# EAGLE design ipod_connector (EAGLE 5.10)
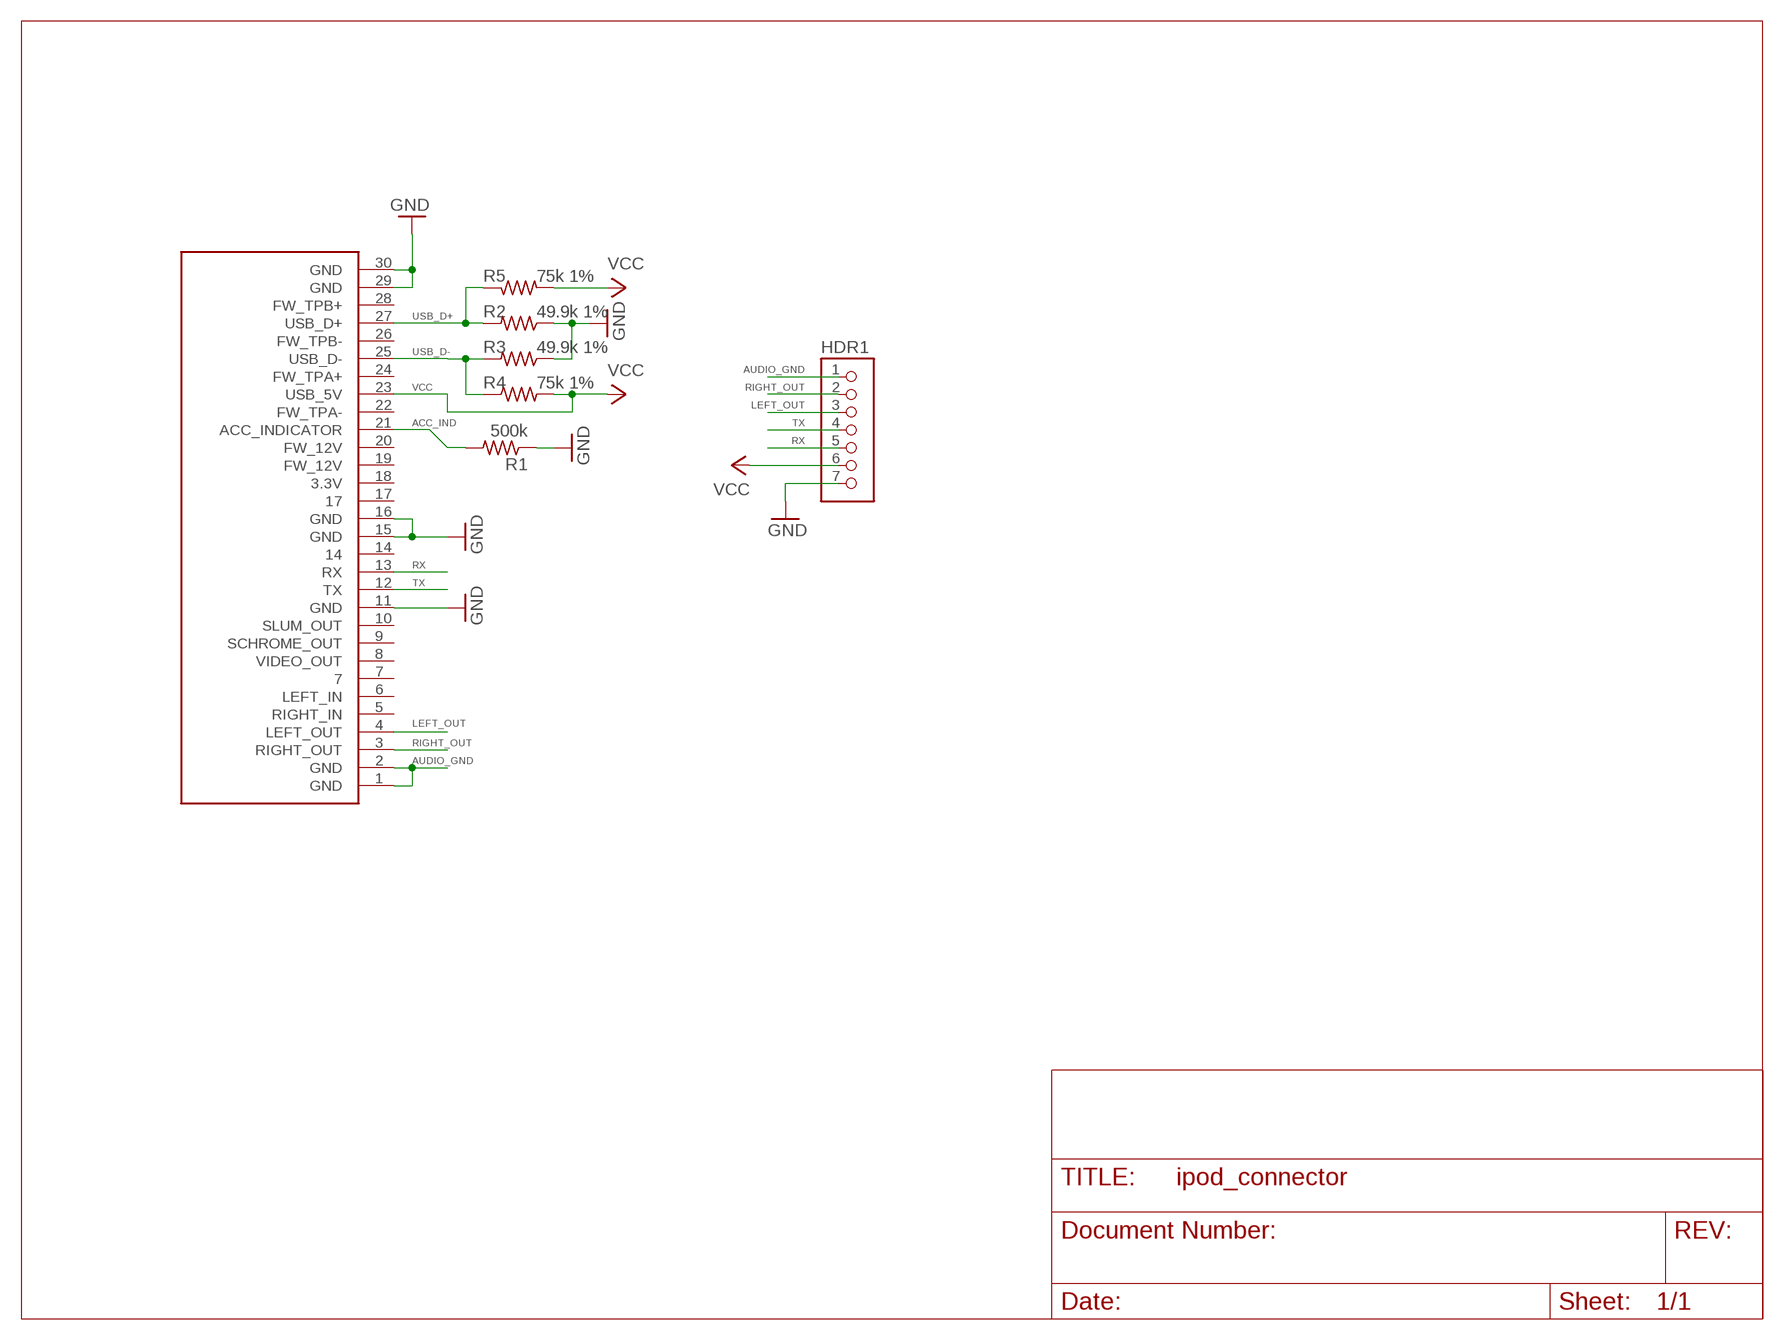
[diagram p0: schematic, sheet 1]

## Parts
HDR1  SMHDR-1X7  [SMHDR-1X7]
R1  500k  R-US_R0603  [R0603]
R2  49.9k 1%  R-US_R0603  [R0603]
R3  49.9k 1%  R-US_R0603  [R0603]
R4  75k 1%  R-US_R0603  [R0603]
R5  75k 1%  R-US_R0603  [R0603]
U$1  IPOD_CONNECTOR_MALE  [IPOD_MALE_CONNECTOR]

## Nets
ACC_IND: R1.2 U$1.21(ACC_INDICATOR)
AUDIO_GND: HDR1.1 U$1.1(GND) U$1.2(GND)
GND: HDR1.7 R1.1 R2.1 R3.1 U$1.11(GND) U$1.15(GND) U$1.16(GND) U$1.29(GND) U$1.30(GND)
LEFT_OUT: HDR1.3 U$1.4(LEFT_OUT)
RIGHT_OUT: HDR1.2 U$1.3(RIGHT_OUT)
RX: HDR1.5 U$1.13(RX)
TX: HDR1.4 U$1.12(TX)
USB_D+: R2.2 R5.1 U$1.27(USB_D+)
USB_D-: R3.2 R4.1 U$1.25(USB_D-)
VCC: HDR1.6 R4.2 R5.2 U$1.23(USB_5V)
Unconnected: U$1.5(RIGHT_IN) U$1.6(LEFT_IN) U$1.7 U$1.8(VIDEO_OUT) U$1.9(SCHROME_OUT) U$1.10(SLUM_OUT) U$1.14 U$1.17 U$1.18(3.3V) U$1.19(FW_12V) U$1.20(FW_12V) U$1.22(FW_TPA-) U$1.24(FW_TPA+) U$1.26(FW_TPB-) U$1.28(FW_TPB+)

## Library data of the parts
HDR1 = ipod_lib:SMHDR-1X7
R1-R5 = resistor:R-US_: RESISTOR, American symbol
U$1 = SparkFun:IPOD_CONNECTOR_MALE: iPod Male Connector This is the connector that will insert into an iPods. Use this connector to gain access to the various iPod pins. Schematic and footprint are not yet production proven. The PCB thickness must be more thin than the standard 0.062" FR4. Spark Fun Electronics SKU : DEV-00633

## Board
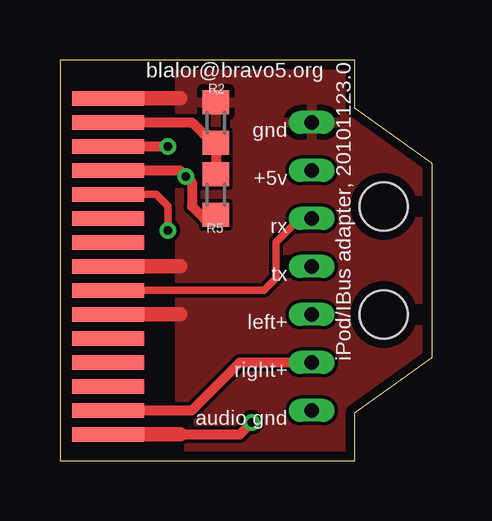
[diagram p1: board, top side]
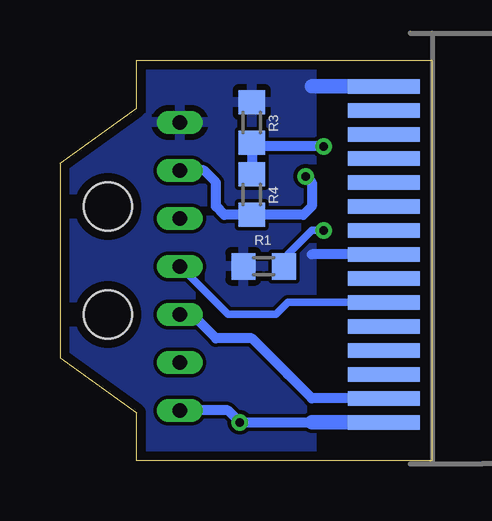
[diagram p2: board, bottom side, seen from below]

Size 15.5 x 16.7 mm. Coordinates in mm from the lower left corner, seen from the top.
Outline: 0,0 12.3,0 12.3,2 15.5,4.3 15.5,12.4 12.3,14.7 12.3,16.7 0,16.7 0,0
Copper layers (1*16): Top 0.0356mm / dielectric 1.5011mm / Bottom 0.0356mm
Design rules "LaenPCBOrder": minimum track width 6mil, minimum drill 13mil, track to track 6mil, track to pad 6mil, pad to pad 6mil, via to via 6mil, smd to smd 6mil, copper to edge 15mil, drill to drill 6mil, minimum pad ring 7mil, minimum via ring 7mil, stop-mask expansion 4mil, vias tented up to drill 0mil, thermal gap 10mil
Holes 2 mm at 13.5,10.6 13.5,6.1

### Footprints (pad centres in the part's own frame; a part is rotated, then mirrored left to right if it is on the bottom)
SMHDR-1X7 = drill 0.6 long: 1 0,0; 2 0,2; 3 0,4; 4 0,6; 5 0,8; 6 0,10; 7 0,12
R0603 = smd 1 x 1.1: 1 -0.85,0; 2 0.85,0
IPOD_MALE_CONNECTOR = smd 0.6 x 3 bottom: 1 7.5,0; 3 6.5,0; 5 5.5,0; 7 4.5,0; 9 3.5,0; 11 2.5,0; 13 1.5,0; 15 0.5,0; 17 -0.5,0; 19 -1.5,0; 21 -2.5,0; 23 -3.5,0; 25 -4.5,0; 27 -5.5,0; 29 -6.5,0 | smd 0.6 x 3: 2 7,0; 4 6,0; 6 5,0; 8 4,0; 10 3,0; 12 2,0; 14 1,0; 16 0,0; 18 -1,0; 20 -2,0; 22 -3,0; 24 -4,0; 26 -5,0; 28 -6,0; 30 -7,0

### Placement (x,y rotation side)
HDR1  10.5,2.1 0 bottom
R1  7,8.1 0 bottom
R2  6.5,14.1 270 top
R3  7.5,14.1 270 bottom
R4  7.5,11.1 270 bottom
R5  6.5,11.1 270 top
U$1  2,8.6 270 bottom

### Tracks (layer width: path | path; a pad name or v marks a point on that pad's centre or on a via)
ACC_IND  (via drill 0.34)
  Top 0.305: U$1.21 4,11.1 4.5,10.6 v4.5,9.6
  Bottom 0.305: v4.5,9.6 5,9.6 5.5,9.1 6,8.6 6,8.25 R1.2
AUDIO_GND  (via drill 0.34)
  Top 0.406: U$1.1 7.5,1.1 v8,1.6
  Top 0.6: U$1.1 5,1.1
  Bottom 0.406: 5,1.6 v8,1.6 8.5,2.1 HDR1.1
  Bottom 0.6: 5,1.6 U$1.2
GND
  Top 0.6: U$1.29 5,15.1 | U$1.15 5,8.1 | U$1.11 5,6.1
  Bottom 0.406: U$1.16 5,8.6
  Bottom 0.6: U$1.30 5,15.6
  pour Bottom: 5,17.7 16,17.7 16,0 5,0
  pour Top: 5,17.7 16,17.7 16,0 5,0
LEFT_OUT
  Bottom 0.406: U$1.4 5,2.6 6,3.6 7.5,5.1 9,5.1 10,6.1 HDR1.3
RIGHT_OUT
  Top 0.406: U$1.3 5.5,2.1 6,2.6 7.5,4.1 HDR1.2
RX
  Top 0.305: U$1.13 8.5,7.1 9,7.6 9,9.1 9.5,9.6 10,10.1 HDR1.5
TX
  Bottom 0.305: U$1.12 6,6.6 6.5,6.1 8.5,6.1 9,6.6 9.5,7.1 HDR1.4
USB_D+
  Top 0.406: U$1.27 5.5,14.1 6,13.6 6.15,13.6 R2.2 R5.1
USB_D-  (via drill 0.34)
  Top 0.406: U$1.25 v4.5,13.1
  Bottom 0.406: v4.5,13.1 7.35,13.1 R3.2 R4.1
VCC  (via drill 0.34)
  Top 0.406: U$1.23 5,12.1 | 5,12.1 v5.25,11.85 | v5.25,11.85 5.5,11.6 5.5,10.6 6,10.1 6.35,10.1 R5.2 | 5,12.1 v5.25,11.85
  Bottom 0.406: v5.25,11.85 5,11.6 5,10.6 5.35,10.25 R4.2 8.65,10.25 9,10.6 9,11.6 9.5,12.1 HDR1.6

### Text on the board
tNames: blalor@bravo5.org | iPod/IBus adapter, 20101123.0 | gnd | +5v | rx | tx | left+ | right+ | audio gnd
tDocu: gnd | usb_d+ | +5v | usb_d- | acc_ind | gnd | gnd | gnd | rx | tx | left+ | right+ | a_gnd | a_gnd
bDocu: gnd